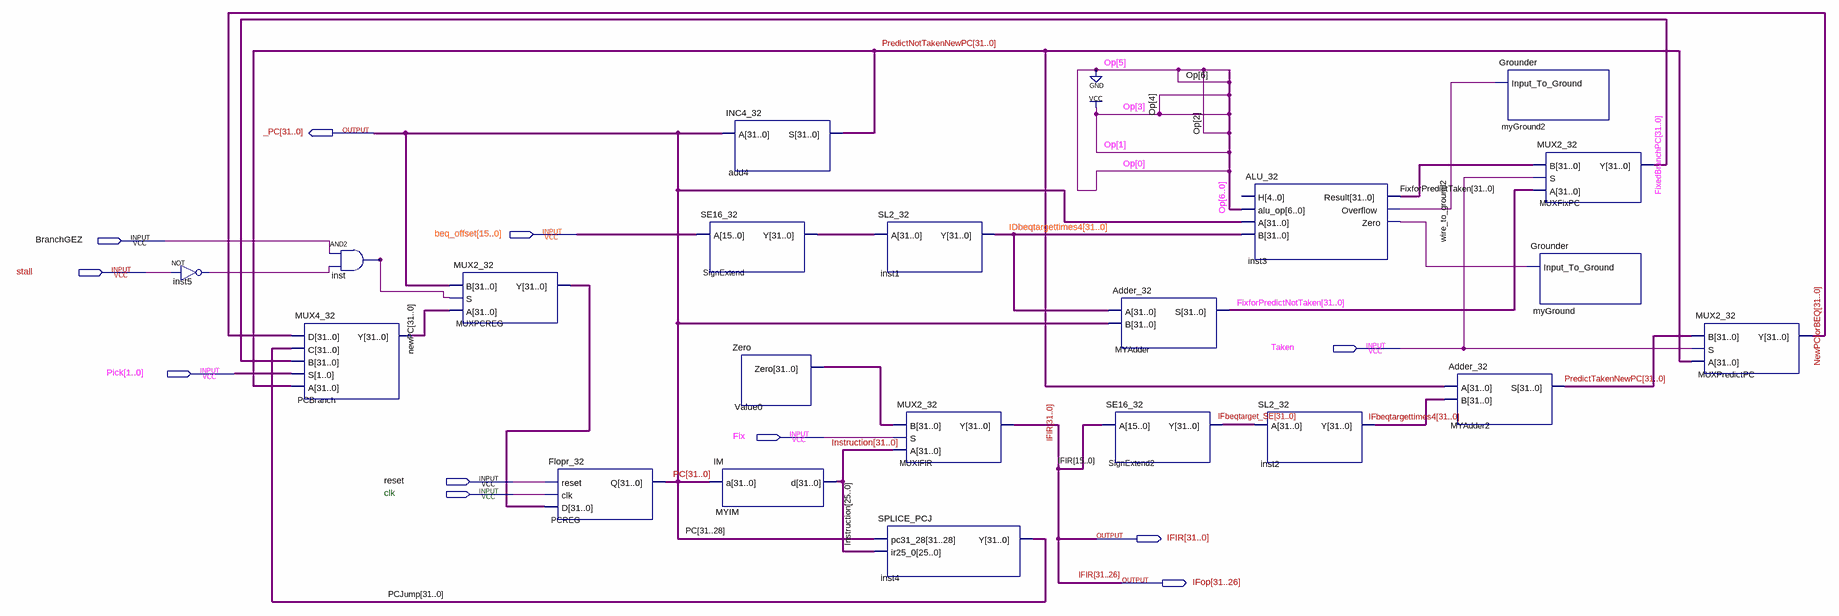
[diagram p0: schematic sheet]
// Quartus schematic IFF.bdf as structural Verilog: 21 symbols, 11 pins
module IFF (
  input  [15:0] beq_offset,
  input  BranchGEZ,
  input  stall,
  input  Taken,
  input  [1:0] Pick,
  input  Fix,
  input  reset,
  input  clk,
  output [31:0] _PC,
  output [31:0] IFIR,
  output [31:26] IFop
);

  wire inst3_zero, inst5_out, inst_out, wire_to_ground2;
  wire [31:0] FixedBranchPC, FixforPredictNotTaken, FixforPredictTaken, IDbeqtargettimes4, IFbeqtarget_SE,
       IFbeqtargettimes4, Instruction, MUXPCREG_y, newPC, NewPCforBEQ, PCJump, PredictNotTakenNewPC,
       PredictTakenNewPC, SignExtend_y, Value0_zero;

  not inst5 (inst5_out, stall);
  MUX4_32 PCBranch (.D(NewPCforBEQ), .C(PCJump), .B(FixedBranchPC), .S(Pick), .A(PredictNotTakenNewPC), .Y(newPC));
  and inst (inst_out, BranchGEZ, inst5_out);
  MUX2_32 MUXPCREG (.B(_PC), .S(inst_out), .A(newPC), .Y(MUXPCREG_y));
  Flopr_32 PCREG (.reset(reset), .clk(clk), .D(MUXPCREG_y), .Q(_PC));
  SE16_32 SignExtend (.A(beq_offset), .Y(SignExtend_y));
  INC4_32 add4 (.A(_PC), .S(PredictNotTakenNewPC));
  Zero Value0 (.Zero(Value0_zero));
  IM MYIM (.a(_PC), .d(Instruction));
  SL2_32 inst1 (.A(SignExtend_y), .Y(IDbeqtargettimes4));
  MUX2_32 MUXIFIR (.B(Value0_zero), .S(Fix), .A(Instruction), .Y(IFIR));
  SPLICE_PCJ inst4 (.pc31_28(_PC[31:28]), .ir25_0(Instruction[25:0]), .Y(PCJump));
  Adder_32 MYAdder (.A(IDbeqtargettimes4), .B(_PC), .S(FixforPredictNotTaken));
  SE16_32 SignExtend2 (.A(IFIR[15:0]), .Y(IFbeqtarget_SE));
  ALU_32 inst3 (
    .alu_op(7'b0011010), .A(_PC), .B(IDbeqtargettimes4), .Result(FixforPredictTaken),
    .Overflow(wire_to_ground2), .Zero(inst3_zero));  // open: H
  SL2_32 inst2 (.A(IFbeqtarget_SE), .Y(IFbeqtargettimes4));
  Adder_32 MYAdder2 (.A(PredictNotTakenNewPC), .B(IFbeqtargettimes4), .S(PredictTakenNewPC));
  Grounder myGround2 (.Input_To_Ground(wire_to_ground2));
  MUX2_32 MUXFixPC (.B(FixforPredictTaken), .S(Taken), .A(FixforPredictNotTaken), .Y(FixedBranchPC));
  Grounder myGround (.Input_To_Ground(inst3_zero));
  MUX2_32 MUXPredictPC (.B(PredictTakenNewPC), .S(Taken), .A(PredictNotTakenNewPC), .Y(NewPCforBEQ));

  assign IFop = IFIR[31:26];

  // Other names for the same wires on the sheet: PC[31:0] = _PC
endmodule
